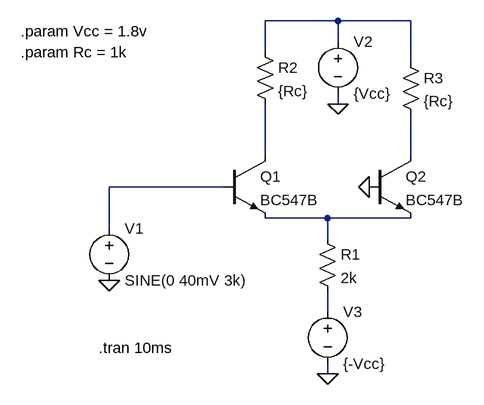
[diagram p0: schematic initial-1-0-2.asc]
initial-1-0-2.asc, the LTspice schematic file:
Version 4
SHEET 1 880 680
WIRE 272 -240 160 -240
WIRE 384 -240 272 -240
WIRE 272 -208 272 -240
WIRE 160 -192 160 -240
WIRE 384 -176 384 -240
WIRE 272 -112 272 -128
WIRE 160 -32 160 -112
WIRE 384 -32 384 -96
WIRE 96 16 -80 16
WIRE 256 64 160 64
WIRE 384 64 256 64
WIRE -80 80 -80 16
WIRE 256 96 256 64
WIRE 256 208 256 176
WIRE 256 304 256 288
FLAG -80 160 0
FLAG 320 16 0
FLAG 272 -112 0
FLAG 256 304 0
SYMBOL res 240 80 R0
SYMATTR InstName R1
SYMATTR Value 2k
SYMBOL voltage -80 64 R0
WINDOW 123 0 0 Left 0
WINDOW 39 0 0 Left 0
SYMATTR InstName V1
SYMATTR Value SINE(0 40mV 3k)
SYMBOL npn 96 -32 R0
SYMATTR InstName Q1
SYMATTR Value BC547B
SYMBOL npn 320 -32 R0
SYMATTR InstName Q2
SYMATTR Value BC547B
SYMBOL res 144 -208 R0
SYMATTR InstName R2
SYMATTR Value {Rc}
SYMBOL res 368 -192 R0
SYMATTR InstName R3
SYMATTR Value {Rc}
SYMBOL voltage 272 -224 R0
WINDOW 123 0 0 Left 0
WINDOW 39 0 0 Left 0
SYMATTR InstName V2
SYMATTR Value {Vcc}
SYMBOL voltage 256 192 R0
WINDOW 123 0 0 Left 0
WINDOW 39 0 0 Left 0
SYMATTR InstName V3
SYMATTR Value {-Vcc}
TEXT -96 264 Left 2 !.tran 10ms
TEXT -216 -224 Left 2 !.param Vcc = 1.8v
TEXT -216 -192 Left 2 !.param Rc = 1k

The netlist it stands for:
* initial-1-0-2.asc
R1 N005 N006 2k
V1 N004 0 SINE(0 40mV 3k)
Q1 N002 N004 N005 0 BC547B
Q2 N003 0 N005 0 BC547B
R2 N001 N002 {Rc}
R3 N001 N003 {Rc}
V2 N001 0 {Vcc}
V3 N006 0 {-Vcc}
.model NPN NPN
.model PNP PNP
.lib standard.bjt
.tran 10ms
.param Vcc = 1.8v
.param Rc = 1k
.backanno
.end